# EAGLE design untitled (EAGLE 9.6.2)
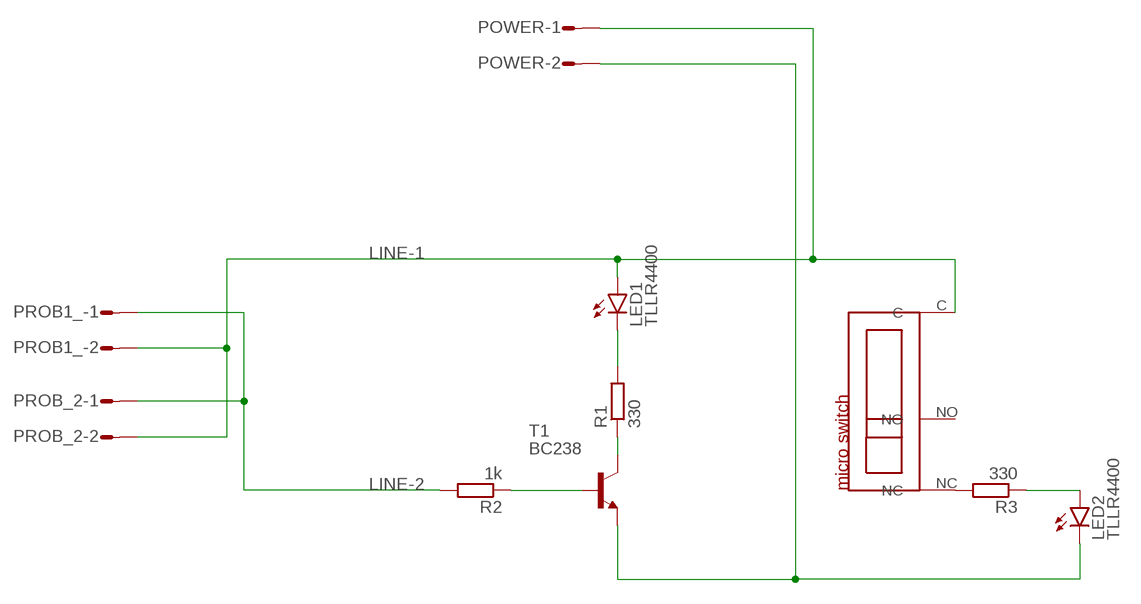
[diagram p0: schematic, sheet 1]

## Parts
LED1  TLLR4400  [LED3MM]
LED2  TLLR4400  [LED3MM]
POWER  L02P  [L02P]
PROB1_  L02P  [L02P]
PROB_2  L02P  [L02P]
R1  330  R-EU_0204/7  [0204/7]
R2  1k  R-EU_0204/7  [0204/7]
R3  330  R-EU_0204/7  [0204/7]
T1  BC238  [TO92]
U$1  MICRO_SWITCH  [MICRO_SWITCH]

## Nets
LINE-1: LED1.A POWER.1 PROB1_.2 PROB_2.2 U$1.C
LINE-2: PROB1_.1 PROB_2.1 R2.2
N$1: R2.1 T1.2(B)
N$2: R1.1 T1.3(C)
N$3: LED2.K(C) POWER.2 T1.1(E)
N$4: LED1.K(C) R1.2
N$5: R3.2 U$1.NC
N$6: LED2.A R3.1
Unconnected: U$1.NO

## Library data of the parts
LED1 LED2 = led:TLLR4400: Low Current (2mA) LED 3 mm Tinted Diffused Package color RED Source: Data sheet <http://www.farnell.com/datasheets/391100.pdf>; MF: VISHAY SEMICONDUCTOR; OC_FARNELL: 1612437
POWER PROB1_ PROB_2 = con-amp-mt:L02P: AMP MT CONNECTOR; OC_FARNELL: unknown; OC_NEWARK: unknown
R1-R3 = rcl:R-EU_: RESISTOR, European symbol; SPICEPREFIX: R
T1 = transistor:BC238: NPN TRANSISTOR
U$1 = leaksensor_lib:MICRO_SWITCH

## Board
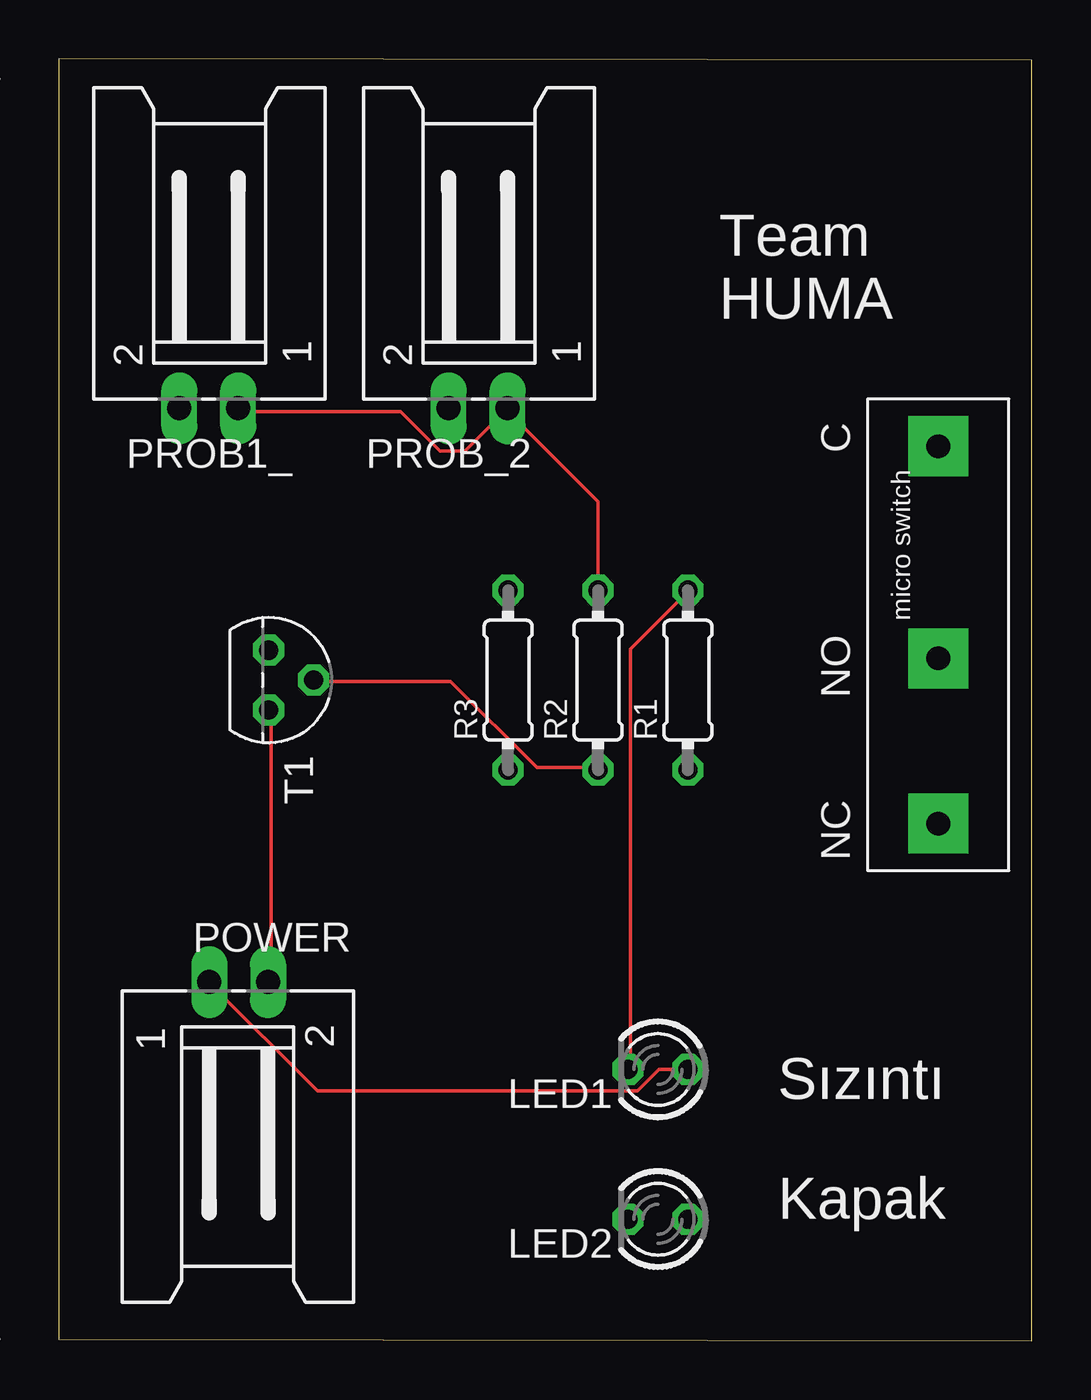
[diagram p1: board, top side]
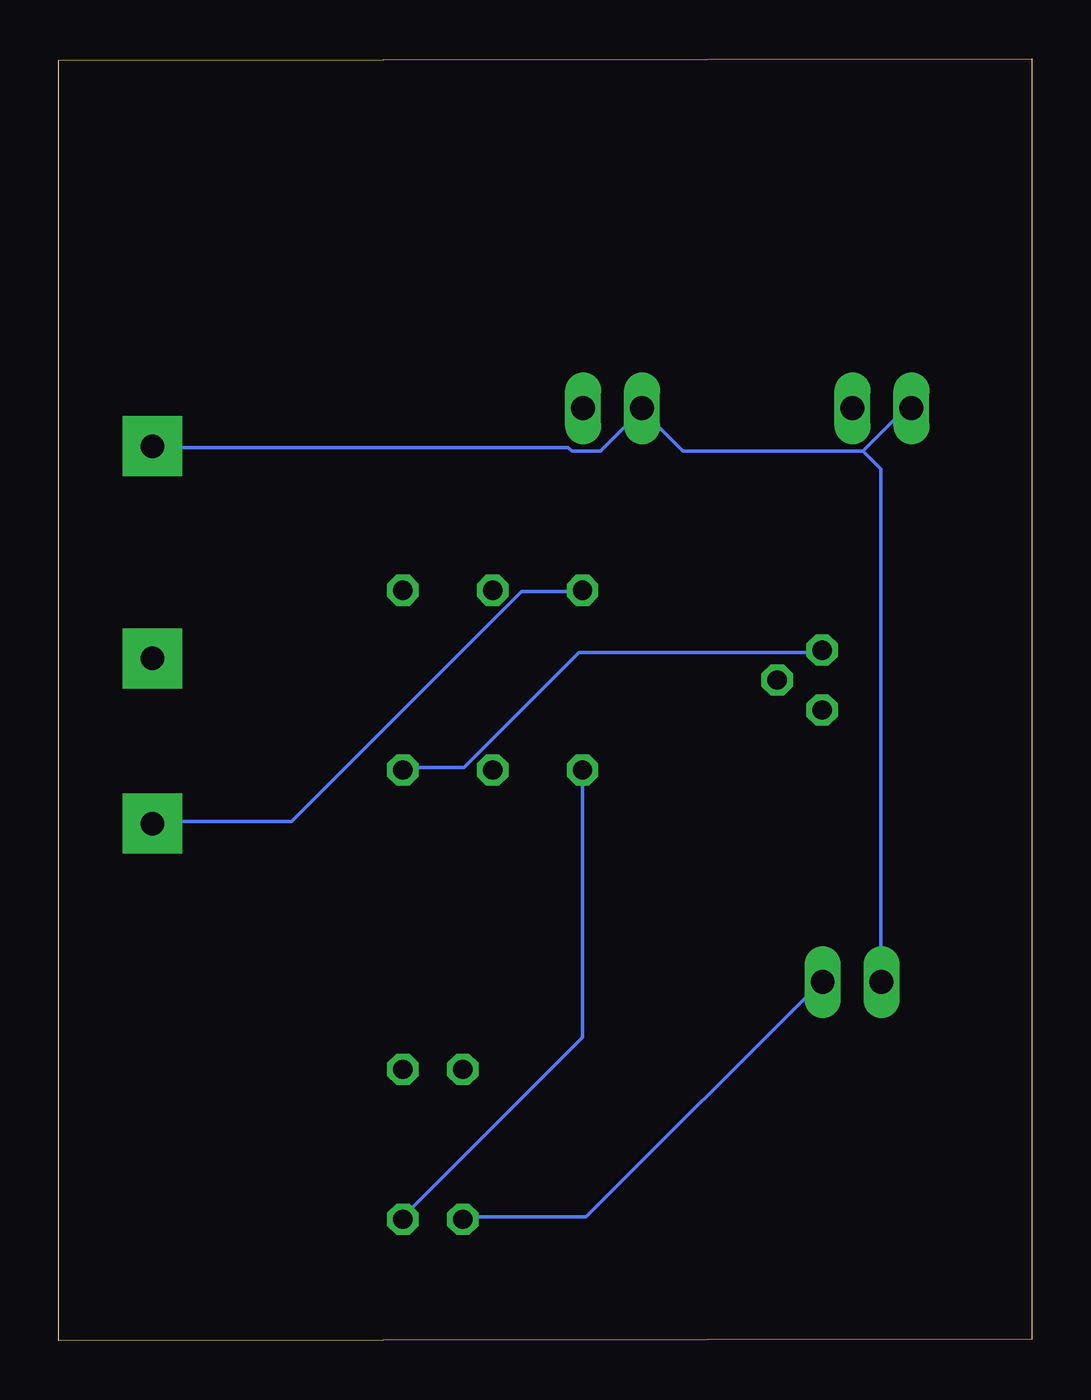
[diagram p2: board, bottom side, seen from below]

Size 41.26 x 54.34 mm. Coordinates in mm from the lower left corner, seen from the top.
Outline: 0,0.06 41.26,0 41.26,54.28 0,54.34 0,0.06
Copper layers (1*16): Top 0.035mm / dielectric 1.5mm / Bottom 0.035mm
Design rules "default": minimum track width 6mil, minimum drill 0.35mm, track to track 6mil, track to pad 6mil, pad to pad 6mil, via to via 6mil, smd to smd 6mil, copper to edge 40mil, drill to drill 6mil, minimum pad ring 10mil, minimum via ring 8mil, stop-mask expansion 4mil, vias tented up to drill 0mil, thermal gap 10mil

### Footprints (pad centres in the part's own frame; a part is rotated, then mirrored left to right if it is on the bottom)
LED3MM = drill 0.813 octagon: A -1.27,0; K 1.27,0
L02P = drill 1.016 long: 1 1.25,-6.25; 2 -1.25,-6.25
0204/7 = drill 0.813 octagon: 1 -3.81,0; 2 3.81,0
TO92 = drill 0.813 octagon: 1 1.27,0; 2 0,1.905; 3 -1.27,0
MICRO_SWITCH = drill 1 pad 2.54 square: C -15,3; NC 1,3; NO -6,3

### Placement (x,y rotation side)
LED1  25.4,11.49 180 top
LED2  25.4,5.14 180 top
POWER  7.62,8.95 180 top
PROB1_  6.35,45.78 0 top
PROB_2  17.78,45.78 0 top
R1  26.67,28 90 top
R2  22.86,28 90 top
R3  19.05,28 90 top
T1  8.89,28 270 top
U$1  34.29,22.92 270 top

### Tracks (layer width: path | path; a pad name or v marks a point on that pad's centre or on a via)
LINE-1
  Top 0.152: LED1.A 25.45,11.49 24.54,10.58 10.97,10.58 6.4,15.15 POWER.1
  Bottom 0.152: 7.16,37.71 5.49,39.38 5.18,39.38 PROB1_.2 | 7.16,37.71 14.78,37.71 16.46,39.38 PROB_2.2 16.61,39.38 18.29,37.71 19.51,37.71 19.66,37.86 37.19,37.86 U$1.C | 7.16,37.71 6.4,36.94 6.4,15.3 POWER.1
LINE-2
  Top 0.152: R2.2 22.86,35.57 19.05,39.38 PROB_2.1 18.9,39.38 17.22,37.71 16.15,37.71 14.48,39.38 7.62,39.38 PROB1_.1
N$1
  Top 0.152: R2.1 22.86,24.3 20.27,24.3 16.61,27.95 10.82,27.95 T1.2
N$2
  Bottom 0.152: R1.1 26.67,24.3 24.08,24.3 19.2,29.17 8.99,29.17 T1.3
N$3
  Top 0.152: T1.1 8.99,26.73 8.99,15.3 POWER.2
  Bottom 0.152: LED2.K 24.08,5.25 18.9,5.25 8.99,15.15 POWER.2
N$4
  Top 0.152: LED1.K 24.23,11.49 24.23,29.32 26.67,31.76 R1.2
N$5
  Bottom 0.152: R3.2 19.05,31.76 21.64,31.76 31.39,22.01 37.19,22.01 U$1.NC
N$6
  Bottom 0.152: R3.1 19.05,12.87 26.67,5.25 LED2.A

### Text on the board
tPlace: Team / HUMA
tNames: Sızıntı | Kapak